# Altium schematic sheet BLE_cube.SchDoc
size 304 x 228 mm; PageSetup: Record=PageOptions|CenterHorizontal=True|CenterVertical=True|PrintScale=0.90|XCorrection=1.00|YCorrection=1.00|PrintKind=0|BorderSize=5000000|LeftOffset=0|BottomOffset=0|Orientation=2|PaperLength=1000|PaperWidth=1000|Scale=100|PaperSource=7|PrintQuality=-3|MediaType=1|DitherType=10|PrintScaleMode=1|PaperKind=A4|PaperIndex=9
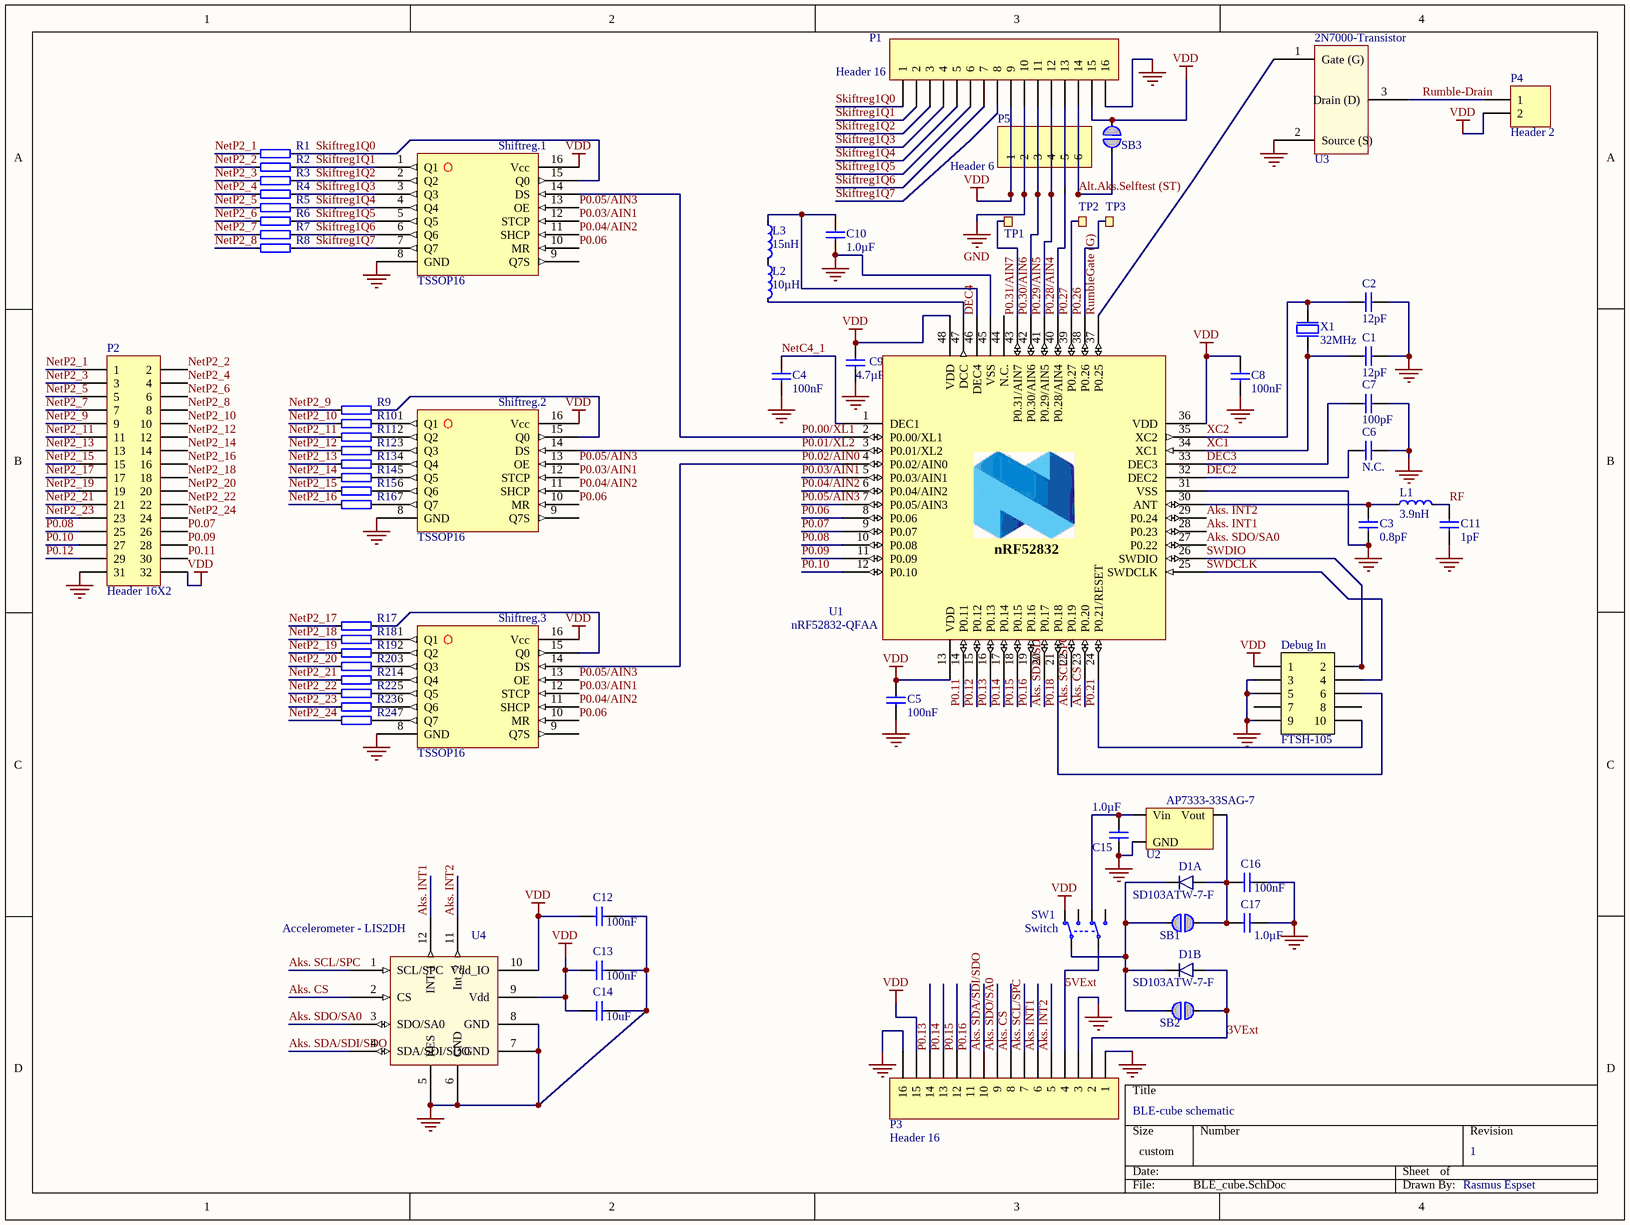
[diagram p0: BLE_cube.SchDoc]

## Parts
C1  12pF  [CAPC1005X04L]
C2  12pF  [CAPC1005X04L]
C3  0.8pF  [CAPC1005X04L]
C4  100nF  [CAPC1005X04L]
C5  100nF  [CAPC1005X04L]
C6  N.C.  [CAPC1005X04L]
C7  100pF  [CAPC1005X04L]
C8  100nF  [CAPC1005X04L]
C9  4.7µF  [CAPC1608X06L]
C10  1.0µF  [CAPC1608X06L]
C11  1pF  [CAPC1005X04L]
C12  100nF  [CAPC1005X04L]
C13  100nF  [CAPC1005X04L]
C14  10uF  [CAPC1005X04L]
C15  1.0µF  [CAPC1608X06L]
C16  100nF  [CAPC1005X04L]
C17  1.0µF  [CAPC1608X06L]
D1  SD103ATW-7-F  [SOT-363]  (parts A,B of 3)
Debug_In  FTSH-105  [FTSH-105-K]
L1  3.9nH  [INDC1005X04L]
L2  10µH  [INDC1608X06L]
L3  15nH  [INDC1005X04L]
P1  Header 16  [HDR1X16]
P2  Header 16X2  [HDR2X16]
P3  Header 16  [HDR1X16]
P4  Header 2  [HDR1X2]
P5  Header 6  [HDR1X6]
R1  N.C.  [RESC1005X04L]  (value not drawn)
R2  N.C.  [RESC1005X04L]  (value not drawn)
R3  N.C.  [RESC1005X04L]  (value not drawn)
R4  N.C.  [RESC1005X04L]  (value not drawn)
R5  N.C.  [RESC1005X04L]  (value not drawn)
R6  N.C.  [RESC1005X04L]  (value not drawn)
R7  N.C.  [RESC1005X04L]  (value not drawn)
R8  N.C.  [RESC1005X04L]  (value not drawn)
R9  N.C.  [RESC1005X04L]  (value not drawn)
R10  N.C.  [RESC1005X04L]  (value not drawn)
R11  N.C.  [RESC1005X04L]  (value not drawn)
R12  N.C.  [RESC1005X04L]  (value not drawn)
R13  N.C.  [RESC1005X04L]  (value not drawn)
R14  N.C.  [RESC1005X04L]  (value not drawn)
R15  N.C.  [RESC1005X04L]  (value not drawn)
R16  N.C.  [RESC1005X04L]  (value not drawn)
R17  N.C.  [RESC1005X04L]  (value not drawn)
R18  N.C.  [RESC1005X04L]  (value not drawn)
R19  N.C.  [RESC1005X04L]  (value not drawn)
R20  N.C.  [RESC1005X04L]  (value not drawn)
R21  N.C.  [RESC1005X04L]  (value not drawn)
R22  N.C.  [RESC1005X04L]  (value not drawn)
R23  N.C.  [RESC1005X04L]  (value not drawn)
R24  N.C.  [RESC1005X04L]  (value not drawn)
SB1  Solderbridge  [Solderbridge]  (value not drawn)  (no BOM)
SB2  Solderbridge  [Solderbridge]  (value not drawn)  (no BOM)
SB3  Solderbridge  [Solderbridge]  (value not drawn)  (no BOM)
Shiftreg.1  TSSOP16  [SOP16]
Shiftreg.2  TSSOP16  [SOP16]
Shiftreg.3  TSSOP16  [SOP16]
SW1  Switch  [JS202011SCQN]
TP1  TP  [TESTPAD-TH]  (value not drawn)  (no BOM)
TP2  TP  [TESTPAD-TH]  (value not drawn)  (no BOM)
TP3  TP  [TESTPAD-TH]  (value not drawn)  (no BOM)
U1  nRF52832-QFAA  [QFN40P600X600X90-48N]
U2  AP7333-33SAG-7  [SOT-23A]
U3  2N7000-Transistor  [SOT-23A]
U4  Accelerometer - LIS2DH  [LGA-12 aks]
X1  32MHz  [BT-XTAL_2016]

## Nets
GND: C1.2 C2.2 C3.1 C4.2 C5.2 C6.1 C7.2 C8.2 C9.2 C10.1 C11.1 C12.2 C13.2 C14.2 C15.1 C16.2 C17.1 Debug_In.3 Debug_In.5 Debug_In.9 P1.10 P1.16 P2.31 P3.1 P3.3 P3.16 P5.2 Shiftreg.1.8(GND) Shiftreg.2.8(GND) Shiftreg.3.8(GND) U1.31(VSS) U1.45(VSS) U1.49(GND) U2.3(GND) U3.2(Source_(S)) U4.5(RES) U4.6(GND) U4.7(GND) U4.8(GND) X1.2(GND) X1.4(GND)
VDD: C5.1 C8.1 C9.1 C12.1 C13.1 C14.1 Debug_In.1 P1.9 P1.15 P2.32 P3.15 P4.2 P5.1 SB3.2 Shiftreg.1.16(Vcc) Shiftreg.2.16(Vcc) Shiftreg.3.16(Vcc) SW1.1(N.O-1) U1.13(VDD) U1.36(VDD) U1.48(VDD) U4.9(Vdd) U4.10(Vdd_IO)
3VExt: D1.5(A2) P3.2 SB2.2
5VExt: P3.4 SW1.5(COM-2)
Aks. CS: P3.8 U1.23(P0.20) U4.2(CS)
Aks. INT1: P3.6 U1.28(P0.23) U4.12(INT_1)
Aks. INT2: P3.5 U1.29(P0.24) U4.11(Int_2)
Aks. SCL/SPC: P3.7 U1.22(P0.19) U4.1(SCL/SPC)
Aks. SDA/SDI/SDO: P3.10 U1.20(P0.17) U4.4(SDA/SDI/SDO)
Aks. SDO/SA0: P3.9 U1.27(P0.22) U4.3(SDO/SA0)
Alt.Aks.Selftest (ST): P1.14 P5.6 SB3.1
DEC2: C6.2 U1.32(DEC2)
DEC3: C7.1 U1.33(DEC3)
DEC4: C10.2 L3.1 U1.46(DEC4)
NetC4_1: C4.1 U1.1(DEC1)
NetP2_1: P2.1 R1.1
NetP2_2: P2.2 R2.1
NetP2_3: P2.3 R3.1
NetP2_4: P2.4 R4.1
NetP2_5: P2.5 R5.1
NetP2_6: P2.6 R6.1
NetP2_7: P2.7 R7.1
NetP2_8: P2.8 R8.1
NetP2_9: P2.9 R9.1
NetP2_10: P2.10 R10.1
NetP2_11: P2.11 R11.1
NetP2_12: P2.12 R12.1
NetP2_13: P2.13 R13.1
NetP2_14: P2.14 R14.1
NetP2_15: P2.15 R15.1
NetP2_16: P2.16 R16.1
NetP2_17: P2.17 R17.1
NetP2_18: P2.18 R18.1
NetP2_19: P2.19 R19.1
NetP2_20: P2.20 R20.1
NetP2_21: P2.21 R21.1
NetP2_22: P2.22 R22.1
NetP2_23: P2.23 R23.1
NetP2_24: P2.24 R24.1
P0.00/XL1: Shiftreg.1.14(DS) U1.2(P0.00/XL1)
P0.01/XL2: Shiftreg.2.14(DS) U1.3(P0.01/XL2)
P0.02/AIN0: Shiftreg.3.14(DS) U1.4(P0.02/AIN0)
P0.03/AIN1: Shiftreg.1.12(STCP) Shiftreg.2.12(STCP) Shiftreg.3.12(STCP) U1.5(P0.03/AIN1)
P0.04/AIN2: Shiftreg.1.11(SHCP) Shiftreg.2.11(SHCP) Shiftreg.3.11(SHCP) U1.6(P0.04/AIN2)
P0.05/AIN3: Shiftreg.1.13(OE) Shiftreg.2.13(OE) Shiftreg.3.13(OE) U1.7(P0.05/AIN3)
P0.06: Shiftreg.1.10(MR) Shiftreg.2.10(MR) Shiftreg.3.10(MR) U1.8(P0.06)
P0.07: P2.26 U1.9(P0.07)
P0.08: P2.25 U1.10(P0.08)
P0.09: P2.28 U1.11(P0.09)
P0.10: P2.27 U1.12(P0.10)
P0.11: P2.30 U1.14(P0.11)
P0.12: P2.29 U1.15(P0.12)
P0.13: P3.14 U1.16(P0.13)
P0.14: P3.13 U1.17(P0.14)
P0.15: P3.12 U1.18(P0.15)
P0.16: P3.11 U1.19(P0.16)
P0.18: Debug_In.6 U1.21(P0.18)
P0.21: Debug_In.10 U1.24(P0.21/RESET)
P0.26: TP3.1 U1.38(P0.26)
P0.27: TP2.1 U1.39(P0.27)
P0.28/AIN4: P5.5 U1.40(P0.28/AIN4)
P0.29/AIN5: P1.12 P5.4 U1.41(P0.29/AIN5)
P0.30/AIN6: P1.11 P5.3 U1.42(P0.30/AIN6)
P0.31/AIN7: TP1.1 U1.43(P0.31/AIN7)
RF: C11.2 L1.2
Rumble-Drain: P4.1 U3.3(Drain_(D))
RumbleGate (G): U1.37(P0.25) U3.1(Gate_(G))
Skiftreg1Q0: P1.1 R1.2 Shiftreg.1.15(Q0)
Skiftreg1Q1: P1.2 R2.2 Shiftreg.1.1(Q1)
Skiftreg1Q2: P1.3 R3.2 Shiftreg.1.2(Q2)
Skiftreg1Q3: P1.4 R4.2 Shiftreg.1.3(Q3)
Skiftreg1Q4: P1.5 R5.2 Shiftreg.1.4(Q4)
Skiftreg1Q5: P1.6 R6.2 Shiftreg.1.5(Q5)
Skiftreg1Q6: P1.7 R7.2 Shiftreg.1.6(Q6)
Skiftreg1Q7: P1.8 R8.2 Shiftreg.1.7(Q7)
SWDCLK: Debug_In.4 U1.25(SWDCLK)
SWDIO: Debug_In.2 U1.26(SWDIO)
XC1: C1.1 U1.34(XC1) X1.1(inp)
XC2: C2.1 U1.35(XC2) X1.3(out)
NetC3_2: C3.2 L1.1 U1.30(ANT)
NetC15_2: C15.2 SW1.6(N.C-2) U2.1(Vin)
NetC16_1: C16.1 C17.2 D1.6(A1) SB1.2 U2.2(Vout)
NetD1_1: D1.1(C1) D1.2(C2) SB1.1 SB2.1 SW1.2(COM-1)
NetL2_1: L2.1 L3.2
NetL2_2: L2.2 U1.47(DCC)
NetR9_2: R9.2 Shiftreg.2.15(Q0)
NetR10_2: R10.2 Shiftreg.2.1(Q1)
NetR11_2: R11.2 Shiftreg.2.2(Q2)
NetR12_2: R12.2 Shiftreg.2.3(Q3)
NetR13_2: R13.2 Shiftreg.2.4(Q4)
NetR14_2: R14.2 Shiftreg.2.5(Q5)
NetR15_2: R15.2 Shiftreg.2.6(Q6)
NetR16_2: R16.2 Shiftreg.2.7(Q7)
NetR17_2: R17.2 Shiftreg.3.15(Q0)
NetR18_2: R18.2 Shiftreg.3.1(Q1)
NetR19_2: R19.2 Shiftreg.3.2(Q2)
NetR20_2: R20.2 Shiftreg.3.3(Q3)
NetR21_2: R21.2 Shiftreg.3.4(Q4)
NetR22_2: R22.2 Shiftreg.3.5(Q5)
NetR23_2: R23.2 Shiftreg.3.6(Q6)
NetR24_2: R24.2 Shiftreg.3.7(Q7)

Not connected (* = marked no-connect by the designer): Debug_In 7 8; P1 13; Shiftreg.1 9(Q7S); Shiftreg.2 9(Q7S); Shiftreg.3 9(Q7S); SW1 3(N.C-1) 4(N.O-2); U1 44(N.C.)

## Notes on the sheet
- (near P3) BLE-cube schematic
- 1
- Rasmus Espset
- (in symbol nRF52832-QFAA) nRF52832

## Library data of the parts
C1 C2 C12-C14 = C0402-12p: Capacitor, NP0, ±2%; Note: 50V; Artikkelnr Noca: 20029159; Artikkelnr Simpro: N.A.; Part Number: C0402-12p; Manufacturer: *; Manufacturer Part Number: *; Datasheet: *; LatestRevisionDate: 2011-05-11; Pin Count: 2; Publisher: Nordic Semiconductor; Published: 2009-05-08; Supplier: *; Supplier part number: *; 2nd source Supplier: *; 2nd source part number: *; Footprint Doc: 0402
  C1 C2: Value: 12pF
  C12 C13: Value: 100nF
  C14: Value: 10uF
C3 = C0402-0.8p: Capacitor, NP0, ±5%; Note: 50V; Artikkelnr Noca: 20029147; Artikkelnr Simpro: N.A.; Part Number: C0402-0.8p; Manufacturer: *; Manufacturer Part Number: *; Datasheet: *; LatestRevisionDate: 2012-11-21; Pin Count: 2; Publisher: Nordic Semiconductor; Published: 2009-05-08; Value: 0.8pF; Supplier: *; Supplier part number: *; 2nd source Supplier: *; 2nd source part number: *; Footprint Doc: 0402
C4 C5 C8 = C0402-100n: Capacitor, X7R, ±10%; Note: 16V; Artikkelnr Noca: 20039200; Artikkelnr Simpro: N.A.; Part Number: C0402-100n; Manufacturer: *; Manufacturer Part Number: *; Datasheet: *; LatestRevisionDate: 2009-11-23; Pin Count: 2; Publisher: Nordic Semiconductor; Published: 2009-05-08; Value: 100nF; Supplier: *; Supplier part number: *; 2nd source Supplier: *; 2nd source part number: *; Footprint Doc: 0402
C6 = C0402-N.C.: Not mounted; Note: Chip Cap; Artikkelnr Noca: N.A.; Part Number: C0402-N.C.; Manufacturer: *; Manufacturer Part Number: *; Datasheet: *; LatestRevisionDate: 2009-05-08; Pin Count: 2; Publisher: Nordic Semiconductor; Published: 2009-05-08; Value: N.C.; Supplier: *; Supplier part number: *; 2nd source Supplier: *; 2nd source part number: *; Footprint Doc: 0402; Artikkelnr Simpro: N.A.
C7 = C0402-100p: Capacitor, NP0, ±5%; Note: 50V; Artikkelnr Noca: 20029135; Artikkelnr Simpro: N.A.; Part Number: C0402-100p; Manufacturer: *; Manufacturer Part Number: *; Datasheet: *; LatestRevisionDate: 2009-05-08; Pin Count: 2; Publisher: Nordic Semiconductor; Published: 2009-05-08; Value: 100pF; Supplier: *; Supplier part number: *; 2nd source Supplier: *; 2nd source part number: *; Footprint Doc: 0402
C9 = C0603-4µ7: Capacitor, X5R, ±10%; Note: 6.3V; Artikkelnr Noca: 20069060; Artikkelnr Simpro: N.A.; Part Number: C0603-4µ7; Manufacturer: *; Manufacturer Part Number: *; Datasheet: *; LatestRevisionDate: 2009-11-23; Pin Count: 2; Publisher: Nordic Semiconductor; Published: 2009-05-08; Value: 4.7µF; Supplier: *; Supplier part number: *; 2nd source Supplier: *; 2nd source part number: *; Footprint Doc: 0603
C10 C15 C17 = C0603-1µ0: Capacitor, X7R, ±10%; Note: 16V; Artikkelnr Noca: 20039335; Artikkelnr Simpro: N.A.; Part Number: C0603-1µ0; Manufacturer: *; Manufacturer Part Number: *; Datasheet: *; LatestRevisionDate: 2013-06-05; Pin Count: 2; Publisher: Nordic Semiconductor; Published: 2009-05-08; Value: 1.0µF; Supplier: *; Supplier part number: *; 2nd source Supplier: *; 2nd source part number: *; Footprint Doc: 0603
C11 = CAP_0402: Capacitor, NP0, ±0.1pF; Part Number: C0402-1.2p; Note: 50V; Artikkelnr Noca: 20029157; Artikkelnr Simpro: N.A.; Manufacturer: *; Manufacturer Part Number: *; Datasheet: *; LatestRevisionDate: 2011-05-11; Pin Count: 2; Publisher: Nordic Semiconductor; Published: 2009-05-08; Value: 1pF; Supplier: *; Supplier part number: *; 2nd source Supplier: *; 2nd source part number: *; Footprint Doc: 0402
C16 = C0402-12p: Capacitor, X7R, ±10%; Note: 50V; Artikkelnr Noca: 20029159; Artikkelnr Simpro: N.A.; Part Number: C0402-12p; Manufacturer: *; Manufacturer Part Number: *; Datasheet: *; LatestRevisionDate: 2011-05-11; Pin Count: 2; Publisher: Nordic Semiconductor; Published: 2009-05-08; Value: 100nF; Supplier: *; Supplier part number: *; 2nd source Supplier: *; 2nd source part number: *; Footprint Doc: 0402
D1 = SD103ATW-7-F: Surface Mount Schottky Barrier Diode Array; Manufacturer: Diodes Incorporated; 2nd source part number: 177-3507; Artikkelnr Noca: 10029109; Artikkelnr Simpro: N.A.; Part Number: SD103ATW-7-F; Manufacturer Part Number: SD103ATW-7-F; Datasheet: http://www.diodes.com/datasheets/ds30374.pdf; LatestRevisionDate: 2012-06-15; Publisher: Nordic Semiconductor; Published: 2012-06-15; Value: SD103ATW-7-F; Note: *; Supplier: Digi-Key; Supplier part number: SD103ATW-FDITR-ND; 2nd source Supplier: Farnell; Footprint Doc: SOT-363
Debug_In = FTSH-105-01-F-DV-K: SAMTEC - CONN HEADER 10POS DUAL .05" SMD KEYING SHROUD; Part Number: Samtec FTSH-105 Keying Shroud; Note: HEADER, 1.27MM, SMD, 10WAY, Keying Shroud; Artikkelnr Noca: N.A.; Manufacturer: Samtec; Manufacturer Part Number: FTSH-105-01-F-DV-K; Datasheet: http://www.digikey.com/product-detail/en/FTSH-105-01-F-DV-K-P-TR/FTSH-105-01-F-DV-K-P-TR-ND/2649977; LatestRevisionDate: 2014-05-23; Pin Count: 10; Publisher: Nordic Semiconductor; Published: 2014-05-23; Value: FTSH-105; Supplier: Digi-Key; Supplier part number: FTSH-105-01-F-DV-K-P-TR-ND; 2nd source Supplier: *; 2nd source part number: *; Footprint Doc: FTSH-105; Artikkelnr Simpro: N.A.
L1 = L0402-3n9: High frequency chip inductor ±5%; Manufacturer: Murata; Manufacturer Part Number: LQP15MN3N9B02D; Artikkelnr Noca: 33029151; Artikkelnr Simpro: N.A.; Part Number: L0402-3n9; Datasheet: http://search.murata.co.jp/Ceramy/image/img/PDF/ENG/L0075S0084LQP15M.pdf; LatestRevisionDate: 2012-09-19; Pin Count: 2; Publisher: Nordic Semiconductor; Published: 2009-05-08; Value: 3.9nH; Note: High frequency chip inductor ±5%; Supplier: Digi-Key; Supplier part number: 490-1131-1-ND; 2nd source Supplier: *; 2nd source part number: *; Footprint Doc: 0402
L2 = L0603-10µ: Chip inductor, IDC,min = 50 mA, ±20%; Manufacturer: Taiyo Yuden; Manufacturer Part Number: LBMF1608T100K; 2nd source part number: 178-6105; Note: LBMF1608T100K 10µH 80mA 0603; Artikkelnr Noca: 33029314; Artikkelnr Simpro: N.A.; Part Number: L0603-10µ; Datasheet: http://www.yuden.co.jp/ut/product/pdf/elb2_e.pdf; LatestRevisionDate: 2012-09-19; Pin Count: 2; Publisher: Nordic Semiconductor; Published: 2010-02-24; Value: 10µH; Supplier: Digi-Key; Supplier part number: 587-1714-1-ND; 2nd source Supplier: Farnell; Footprint Doc: 0603
L3 = L0402-15n: High frequency chip inductor ±10%; Manufacturer: Taiyo Yuden; Manufacturer Part Number: HK100515NJ-T; 2nd source part number: 658-1328; Artikkelnr Noca: 33029323; Artikkelnr Simpro: N.A.; Part Number: L0402-15n; LatestRevisionDate: 2012-09-19; Pin Count: 2; Publisher: Nordic Semiconductor; Published: 2010-07-12; Value: 15nH; Note: High frequency chip inductor ±10%; Supplier: Digi-Key; Datasheet: http://www.yuden.co.jp/productdata/catalog/en/mlci04_e.pdf; Supplier part number: 587-1521-1-ND; 2nd source Supplier: Farnell; Footprint Doc: 0402
P1 P3 = Header 16: Header, 16-Pin; LatestRevisionDate: 17-Jul-2002; LatestRevisionNote: Re-released for DXP Platform.; Publisher: Altium Limited
P2 = Header 16X2: Header, 16-Pin, Dual row; LatestRevisionDate: 17-Jul-2002; LatestRevisionNote: Re-released for DXP Platform.; Publisher: Altium Limited
P4 = Header 2: Header, 2-Pin; LatestRevisionDate: 17-Jul-2002; LatestRevisionNote: Re-released for DXP Platform.; Publisher: Altium Limited
P5 = Header 6: Header, 6-Pin; LatestRevisionDate: 17-Jul-2002; LatestRevisionNote: Re-released for DXP Platform.; Publisher: Altium Limited
R1-R24 = RES_0402: Not mounted; Part Number: R0402-N.C.; Note: Chip Res; Artikkelnr Noca: N.A.; Manufacturer: *; Manufacturer Part Number: *; Datasheet: *; Footprint Doc: 0402; LatestRevisionDate: 2009-05-08; Pin Count: 2; Publisher: Nordic Semiconductor; Published: 2009-05-08; Value: N.C.; Supplier: *; Supplier part number: *; 2nd source Supplier: *; 2nd source part number: *; Artikkelnr Simpro: N.A.
SB1-SB3 = Solderbridge: Artikkelnr Noca: N.A.; Part Number: Solderbridge; Manufacturer: *; Manufacturer Part Number: *; Datasheet: *; LatestRevisionDate: 2009-12-14; Pin Count: 2; Publisher: Nordic Semiconductor; Published: 2009-12-14; Value: Solderbridge; Note: *; Supplier: *; Supplier part number: *; 2nd source Supplier: *; 2nd source part number: *; Footprint Doc: Solderbridge; Artikkelnr Simpro: N.A.
Shiftreg.1-Shiftreg.3 = TSSOP16: Shiftregister, 74HC595
SW1 = SW-DPDT: SMD slide Switch (ON-ON); Manufacturer: C&K Components; 2nd source part number: 232-0019; Artikkelnr Noca: N.A.; Part Number: JS202011SCQN; Manufacturer Part Number: JS202011SCQN; Datasheet: http://www.ck-components.com/14398/js_14july11.pdf/; LatestRevisionDate: 2014-06-24; Pin Count: 6; Publisher: Nordic Semiconductor; Published: 2014-06-24; Value: Switch; Note: *; Supplier: Digi-Key; Supplier part number: 401-2002-1-ND; 2nd source Supplier: Farnell; Footprint Doc: JS202011SCQN; Artikkelnr Simpro: N.A.
TP1-TP3 = TESTPAD_TH: Testpoint, through hole; Part Number: Testpoint TH; Artikkelnr Noca: N.A.; Manufacturer: *; Manufacturer Part Number: *; Datasheet: *; Footprint Doc: TESTPAD-TH; LatestRevisionDate: 2009-12-12; Pin Count: 1; Publisher: Nordic Semiconductor; Published: 2009-12-12; Value: TP; Note: *; Supplier: *; Supplier part number: *; 2nd source Supplier: *; 2nd source part number: *; Artikkelnr Simpro: N.A.
U1 = nRF52832-QFAA: Multi-protocol Bluetooth Low Energy and 2.4GHz proprietary system-on-chip; Manufacturer: Nordic Semiconductor; Artikkelnr Noca: N.A.; Part Number: nRF52832-QFAA; Manufacturer Part Number: nRF52832-QFAA; Datasheet: *; LatestRevisionDate: 2014-11-26; Pin Count: 48; Publisher: Nordic Semiconductor; Published: 2014-11-26; Value: nRF52832-QFAA; Note: *; Supplier: Nordic Semiconductor; Supplier part number: *; 2nd source Supplier: *; 2nd source part number: *; Footprint Doc: QFN-48; Artikkelnr Simpro: N.A.
U2 = AP7333-33SAG-7: 300mA, Low Quiescent Current, Fast Transient Low Dropout Linear Regulator; Manufacturer: Diodes Incorporated; Artikkelnr Noca: 17039216; Artikkelnr Simpro: N.A.; Part Number: AP7333-33SAG-7; Manufacturer Part Number: AP7333-33SAG-7; Datasheet: http://www.diodes.com/datasheets/AP7333.pdf; LatestRevisionDate: 2012-06-15; Pin Count: 3; Publisher: Nordic Semiconductor; Published: 2012-06-15; Value: AP7333-33SAG-7; Note: *; Supplier: Digi-Key; Supplier part number: AP7333-33SAG-7DICT-ND; 2nd source Supplier: *; 2nd source part number: *; Footprint Doc: SOT-23-3
U4 = LIS2DH12
X1 = XTAL_SMD2016_32MHz_8pF_Epson: XTAL SMD 2016, 32MHz, Cl=8pF, Total Tol: ±40ppm; Manufacturer: Epson Toyocom; Manufacturer Part Number: Q22FA12800025; Note: XTAL SMD 32.000MHz; Artikkelnr Noca: N.A.; Part Number: XTAL_SMD2016_32MHz_8pF_Epson; Datasheet: http://www.epsondevice.com/docs/qd/en/DownloadServlet?id=ID000449; LatestRevisionDate: 2014-11-27; Pin Count: 4; Publisher: Nordic Semiconductor; Published: 2012-03-09; Value: 32MHz; Supplier: Farnell; Supplier part number: 171-2806; 2nd source Supplier: *; 2nd source part number: *; Footprint Doc: XTAL_2016; Artikkelnr Simpro: N.A.